# Altium schematic sheet Main.SchDoc: Main
size A3; Date: 17/09/18; Author: Pablo Sánchez Bergasa; Revision: 2.A.1; SheetNumber: 1; SheetTotal: 10; DocumentName: Main
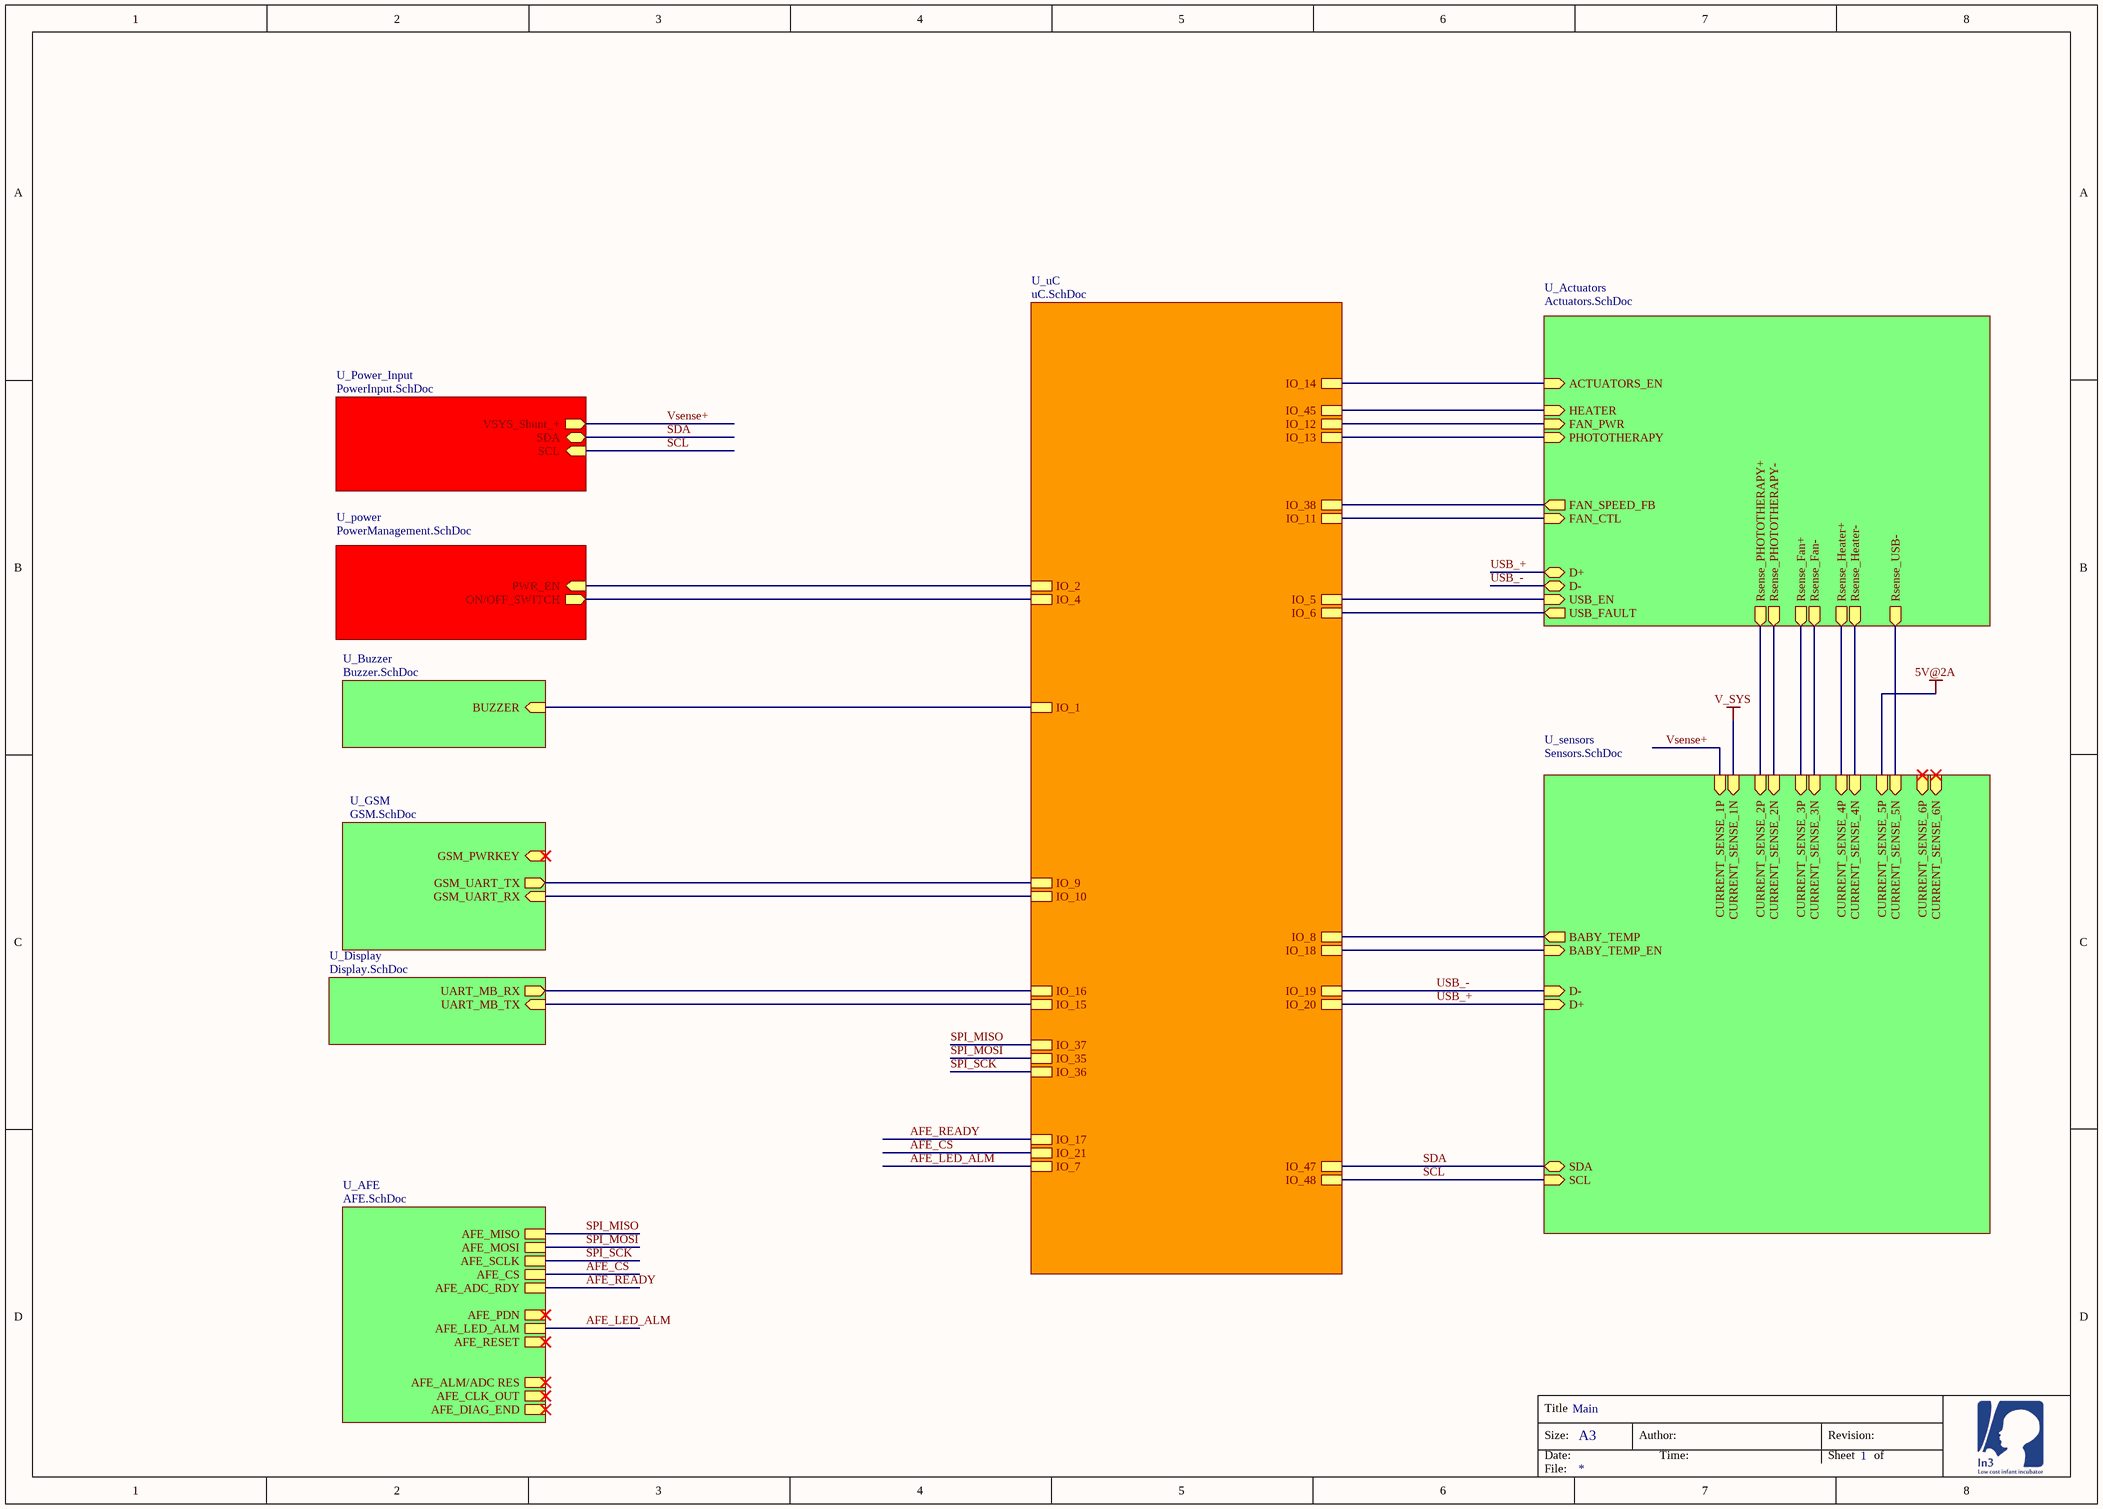
[diagram p0: Main.SchDoc]

## Sub-sheets
U_Actuators = Actuators.SchDoc: HEATER (in), PHOTOTHERAPY (in), Rsense_Fan+ (out), Rsense_Fan- (out), Rsense_PHOTOTHERAPY+ (out), Rsense_PHOTOTHERAPY- (out), ACTUATORS_EN (in), FAN_SPEED_FB (out), Rsense_Heater- (out), Rsense_Heater+ (out), Rsense_USB- (out), USB_EN (in), USB_FAULT (out), FAN_PWR (in), FAN_CTL (in), D+ (bidir), D- (bidir)
U_AFE = AFE.SchDoc: AFE_SCLK, AFE_MISO, AFE_MOSI, AFE_CS, AFE_PDN, AFE_ADC_RDY, AFE_DIAG_END, AFE_LED_ALM, AFE_ALM/ADC RES, AFE_CLK_OUT, AFE_RESET
U_Buzzer = Buzzer.SchDoc: BUZZER (in)
U_Display = Display.SchDoc: UART_MB_TX (in), UART_MB_RX (out)
U_GSM = GSM.SchDoc: GSM_UART_TX (out), GSM_UART_RX (in), GSM_PWRKEY (in)
U_power = PowerManagement.SchDoc: PWR_EN (in), ON/OFF_SWITCH (out)
U_Power_Input = PowerInput.SchDoc: VSYS_Shunt_+ (out), SDA (bidir), SCL (in)
U_sensors = Sensors.SchDoc: BABY_TEMP (out), CURRENT_SENSE_1N (in), CURRENT_SENSE_3N (in), CURRENT_SENSE_2N (in), CURRENT_SENSE_1P (in), CURRENT_SENSE_3P (in), CURRENT_SENSE_2P (in), SCL (in), SDA (bidir), CURRENT_SENSE_6P (in), CURRENT_SENSE_5N (in), CURRENT_SENSE_4P (in), CURRENT_SENSE_4N (in), CURRENT_SENSE_6N (in), CURRENT_SENSE_5P (in), BABY_TEMP_EN (in), D+ (in), D- (in)
U_uC = uC.SchDoc: IO_5, IO_35, IO_37, IO_36, IO_7, IO_21, IO_15, IO_18, IO_14, IO_19, IO_20, IO_38, IO_13, IO_12, IO_16, IO_2, IO_1, IO_11, IO_4, IO_6, IO_8, IO_17, IO_45, IO_9, IO_10, IO_48, IO_47

## Nets
5V@2A: sheet U_sensors/CURRENT_SENSE_5P
V_SYS: sheet U_sensors/CURRENT_SENSE_1N
AFE_CS: sheet U_uC/IO_21, sheet U_AFE/AFE_CS
AFE_LED_ALM: sheet U_uC/IO_7, sheet U_AFE/AFE_LED_ALM
AFE_READY: sheet U_uC/IO_17, sheet U_AFE/AFE_ADC_RDY
SCL: sheet U_sensors/SCL, sheet U_uC/IO_48, sheet U_Power_Input/SCL
SDA: sheet U_sensors/SDA, sheet U_uC/IO_47, sheet U_Power_Input/SDA
SPI_MISO: sheet U_uC/IO_37, sheet U_AFE/AFE_MISO
SPI_MOSI: sheet U_uC/IO_35, sheet U_AFE/AFE_MOSI
SPI_SCK: sheet U_uC/IO_36, sheet U_AFE/AFE_SCLK
USB_+: sheet U_sensors/D+, sheet U_uC/IO_20, sheet U_Actuators/D+
USB_-: sheet U_sensors/D-, sheet U_uC/IO_19, sheet U_Actuators/D-
Vsense+: sheet U_sensors/CURRENT_SENSE_1P, sheet U_Power_Input/VSYS_Shunt_+
(unnamed): sheet U_power/PWR_EN, sheet U_uC/IO_2
(unnamed): sheet U_power/ON/OFF_SWITCH, sheet U_uC/IO_4
(unnamed): sheet U_GSM/GSM_UART_TX, sheet U_uC/IO_9
(unnamed): sheet U_GSM/GSM_UART_RX, sheet U_uC/IO_10
(unnamed): sheet U_sensors/BABY_TEMP, sheet U_uC/IO_8
(unnamed): sheet U_sensors/CURRENT_SENSE_3N, sheet U_Actuators/Rsense_Fan-
(unnamed): sheet U_sensors/CURRENT_SENSE_2N, sheet U_Actuators/Rsense_PHOTOTHERAPY-
(unnamed): sheet U_sensors/CURRENT_SENSE_3P, sheet U_Actuators/Rsense_Fan+
(unnamed): sheet U_sensors/CURRENT_SENSE_2P, sheet U_Actuators/Rsense_PHOTOTHERAPY+
(unnamed): sheet U_sensors/CURRENT_SENSE_5N, sheet U_Actuators/Rsense_USB-
(unnamed): sheet U_sensors/CURRENT_SENSE_4P, sheet U_Actuators/Rsense_Heater+
(unnamed): sheet U_sensors/CURRENT_SENSE_4N, sheet U_Actuators/Rsense_Heater-
(unnamed): sheet U_sensors/BABY_TEMP_EN, sheet U_uC/IO_18
(unnamed): sheet U_uC/IO_5, sheet U_Actuators/USB_EN
(unnamed): sheet U_uC/IO_15, sheet U_Display/UART_MB_TX
(unnamed): sheet U_uC/IO_14, sheet U_Actuators/ACTUATORS_EN
(unnamed): sheet U_uC/IO_38, sheet U_Actuators/FAN_SPEED_FB
(unnamed): sheet U_uC/IO_13, sheet U_Actuators/PHOTOTHERAPY
(unnamed): sheet U_uC/IO_12, sheet U_Actuators/FAN_PWR
(unnamed): sheet U_uC/IO_16, sheet U_Display/UART_MB_RX
(unnamed): sheet U_uC/IO_1, sheet U_Buzzer/BUZZER
(unnamed): sheet U_uC/IO_11, sheet U_Actuators/FAN_CTL
(unnamed): sheet U_uC/IO_6, sheet U_Actuators/USB_FAULT
(unnamed): sheet U_uC/IO_45, sheet U_Actuators/HEATER

## Notes on the sheet
- Title
- Size:
- Date:
- A3
- Author:
- Time:
- Revision:
- Sheet
- of
- File: